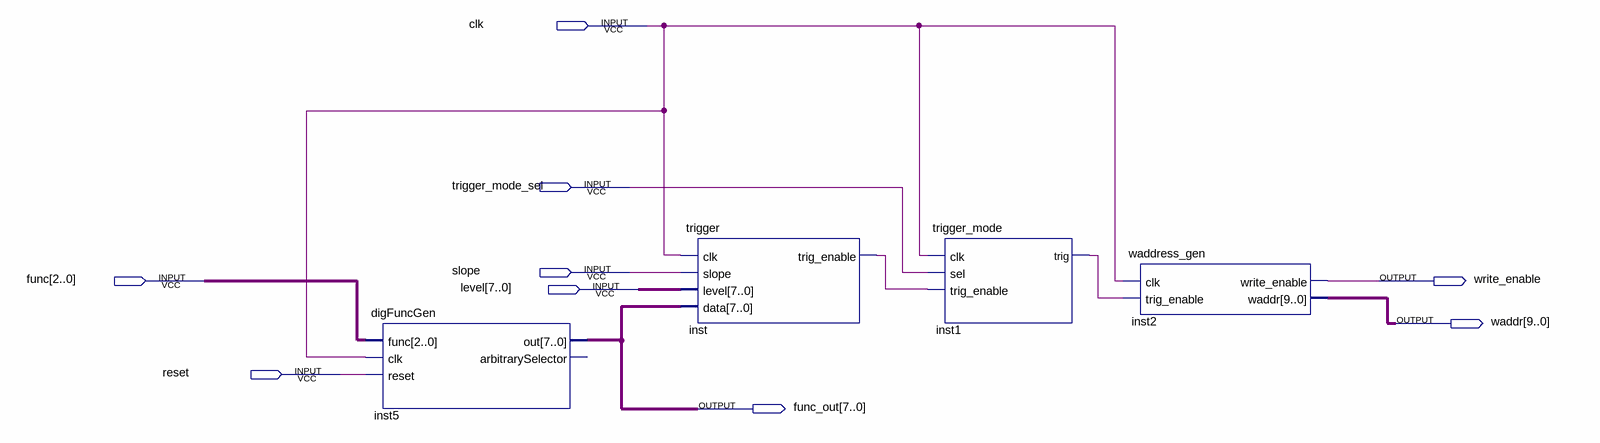
[diagram p0: schematic sheet]
// Quartus schematic trigger_tester.bdf as structural Verilog: 4 symbols, 9 pins
module trigger_tester (
  input  clk,
  input  trigger_mode_sel,
  input  slope,
  input  [2:0] func,
  input  [7:0] level,
  input  reset,
  output write_enable,
  output [9:0] waddr,
  output [7:0] func_out
);

  wire inst1_trig, inst_trig_enable;

  digFuncGen inst5 (.func(func), .clk(clk), .reset(reset), .out(func_out));  // open: arbitrarySelector
  trigger inst (.clk(clk), .slope(slope), .level(level), .data(func_out), .trig_enable(inst_trig_enable));
  trigger_mode inst1 (.clk(clk), .sel(trigger_mode_sel), .trig_enable(inst_trig_enable), .trig(inst1_trig));
  waddress_gen inst2 (.clk(clk), .trig_enable(inst1_trig), .write_enable(write_enable), .waddr(waddr));
endmodule
